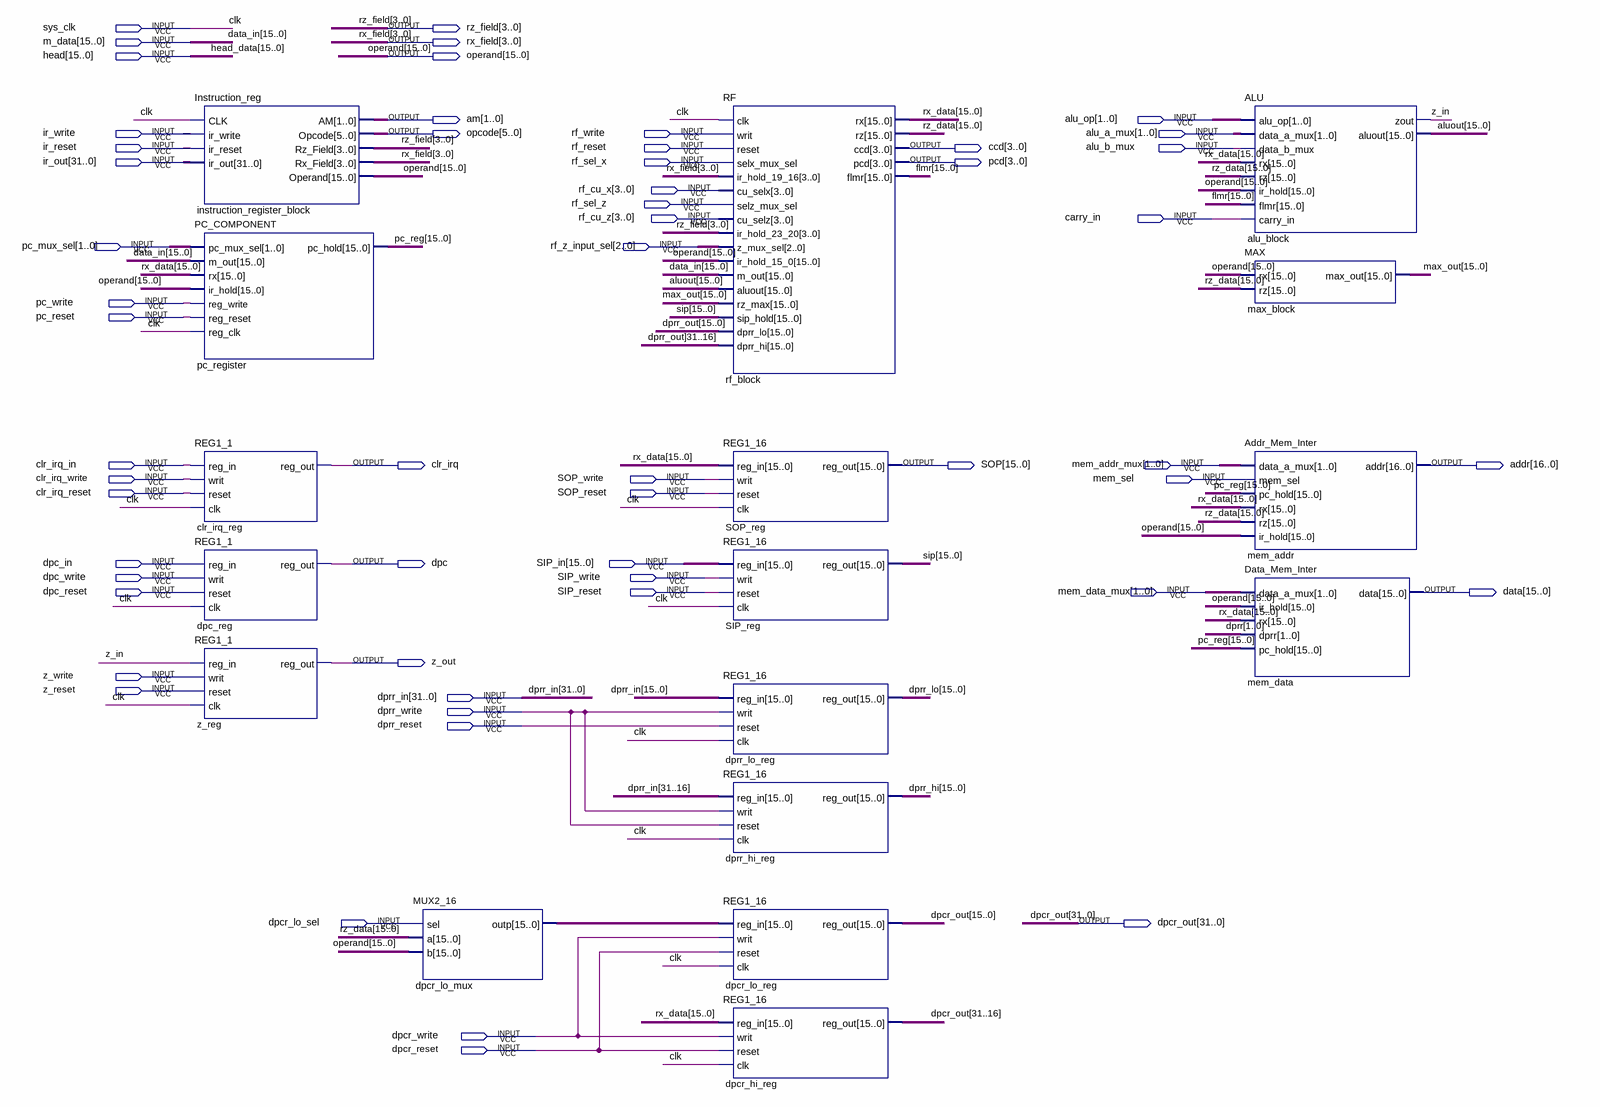
[diagram p0: schematic sheet]
// Quartus schematic Datapath.bdf as structural Verilog: 17 symbols, 56 pins
module Datapath (
  input  sys_clk,
  input  [15:0] m_data,
  input  [15:0] head,
  input  [1:0] alu_op,
  input  ir_write,
  input  rf_write,
  input  [1:0] alu_a_mux,
  input  ir_reset,
  input  rf_reset,
  input  alu_b_mux,
  input  [31:0] ir_out,
  input  rf_sel_x,
  input  [3:0] rf_cu_x,
  input  rf_sel_z,
  input  [3:0] rf_cu_z,
  input  carry_in,
  input  [1:0] pc_mux_sel,
  input  [2:0] rf_z_input_sel,
  input  pc_write,
  input  pc_reset,
  input  clr_irq_in,
  input  [1:0] mem_addr_mux,
  input  clr_irq_write,
  input  SOP_write,
  input  mem_sel,
  input  clr_irq_reset,
  input  SOP_reset,
  input  dpc_in,
  input  [15:0] SIP_in,
  input  dpc_write,
  input  SIP_write,
  input  dpc_reset,
  input  SIP_reset,
  input  [1:0] mem_data_mux,
  input  z_write,
  input  z_reset,
  input  [31:0] dprr_in,
  input  dprr_write,
  input  dprr_reset,
  input  dpcr_lo_sel,
  input  dpcr_write,
  input  dpcr_reset,
  output [3:0] rz_field,
  output [3:0] rx_field,
  output [15:0] operand,
  output [1:0] am,
  output [5:0] opcode,
  output [3:0] ccd,
  output [3:0] pcd,
  output clr_irq,
  output [15:0] SOP,
  output [16:0] addr,
  output dpc,
  output [15:0] data,
  output z_out,
  output [31:0] dpcr_out
);

  wire \dprr_out]31..16] , z_in;
  wire [1:0] dprr;
  wire [15:0] aluout, dpcr_lo_mux_outp, dprr_hi, dprr_lo, dprr_out, flmr, max_out, pc_reg, rx_data, rz_data,
       sip;

  Instruction_reg instruction_register_block (
    .CLK(sys_clk), .ir_write(ir_write), .ir_reset(ir_reset), .ir_out(ir_out), .AM(am), .Opcode(opcode),
    .Rz_Field(rz_field), .Rx_Field(rx_field), .Operand(operand));
  PC_COMPONENT pc_register (
    .pc_mux_sel(pc_mux_sel), .m_out(m_data), .rx(rx_data), .ir_hold(operand), .reg_write(pc_write),
    .reg_reset(pc_reset), .reg_clk(sys_clk), .pc_hold(pc_reg));
  REG1_1 clr_irq_reg (
    .reg_in(clr_irq_in), .writ(clr_irq_write), .reset(clr_irq_reset), .clk(sys_clk), .reg_out(clr_irq));
  REG1_1 dpc_reg (.reg_in(dpc_in), .writ(dpc_write), .reset(dpc_reset), .clk(sys_clk), .reg_out(dpc));
  REG1_1 z_reg (.reg_in(z_in), .writ(z_write), .reset(z_reset), .clk(sys_clk), .reg_out(z_out));
  MUX2_16 dpcr_lo_mux (.a(rz_data), .b(operand), .outp(dpcr_lo_mux_outp));  // open: sel
  RF rf_block (
    .clk(sys_clk), .writ(rf_write), .reset(rf_reset), .selx_mux_sel(rf_sel_x), .ir_hold_19_16(rx_field),
    .selz_mux_sel(rf_sel_z), .ir_hold_23_20(rz_field), .z_mux_sel(rf_z_input_sel), .ir_hold_15_0(operand),
    .m_out(m_data), .aluout(aluout), .rz_max(max_out), .sip_hold(sip), .dprr_lo(dprr_out),
    .dprr_hi({16{\dprr_out]31..16] }}), .rx(rx_data), .rz(rz_data), .ccd(ccd), .pcd(pcd), .flmr(flmr));  // open: cu_selx, cu_selz
  REG1_16 SOP_reg (.reg_in(rx_data), .writ(SOP_write), .reset(SOP_reset), .clk(sys_clk), .reg_out(SOP));
  REG1_16 SIP_reg (.reg_in(SIP_in), .writ(SIP_write), .reset(SIP_reset), .clk(sys_clk), .reg_out(sip));
  REG1_16 dprr_lo_reg (.reg_in(dprr_in[15:0]), .writ(dprr_write), .reset(dprr_reset), .clk(sys_clk), .reg_out(dprr_lo));
  REG1_16 dprr_hi_reg (
    .reg_in(dprr_in[31:16]), .writ(dprr_write), .reset(dprr_write), .clk(sys_clk), .reg_out(dprr_hi));
  REG1_16 dpcr_lo_reg (
    .reg_in(dpcr_lo_mux_outp), .writ(dpcr_write), .reset(dpcr_reset), .clk(sys_clk), .reg_out(dpcr_out[15:0]));
  REG1_16 dpcr_hi_reg (
    .reg_in(rx_data), .writ(dpcr_write), .reset(dpcr_reset), .clk(sys_clk), .reg_out(dpcr_out[31:16]));
  ALU alu_block (
    .alu_op(alu_op), .data_a_mux(alu_a_mux), .data_b_mux(alu_b_mux), .rx(rx_data), .rz(rz_data),
    .ir_hold(operand), .flmr(flmr), .carry_in(carry_in), .zout(z_in), .aluout(aluout));
  MAX max_block (.rx(operand), .rz(rz_data), .max_out(max_out));
  Addr_Mem_Inter mem_addr (
    .data_a_mux(mem_addr_mux), .mem_sel(mem_sel), .pc_hold(pc_reg), .rx(rx_data), .rz(rz_data),
    .ir_hold(operand), .addr(addr));
  Data_Mem_Inter mem_data (
    .data_a_mux(mem_data_mux), .ir_hold(operand), .rx(rx_data), .dprr(dprr), .pc_hold(pc_reg), .data(data));

  // Other names for the same wires on the sheet: clk = sys_clk; data_in[15:0] = m_data; head_data[15:0] = head
endmodule
